# EAGLE schematic Castle_2_2_2_060623 (EAGLE 9.3.0)
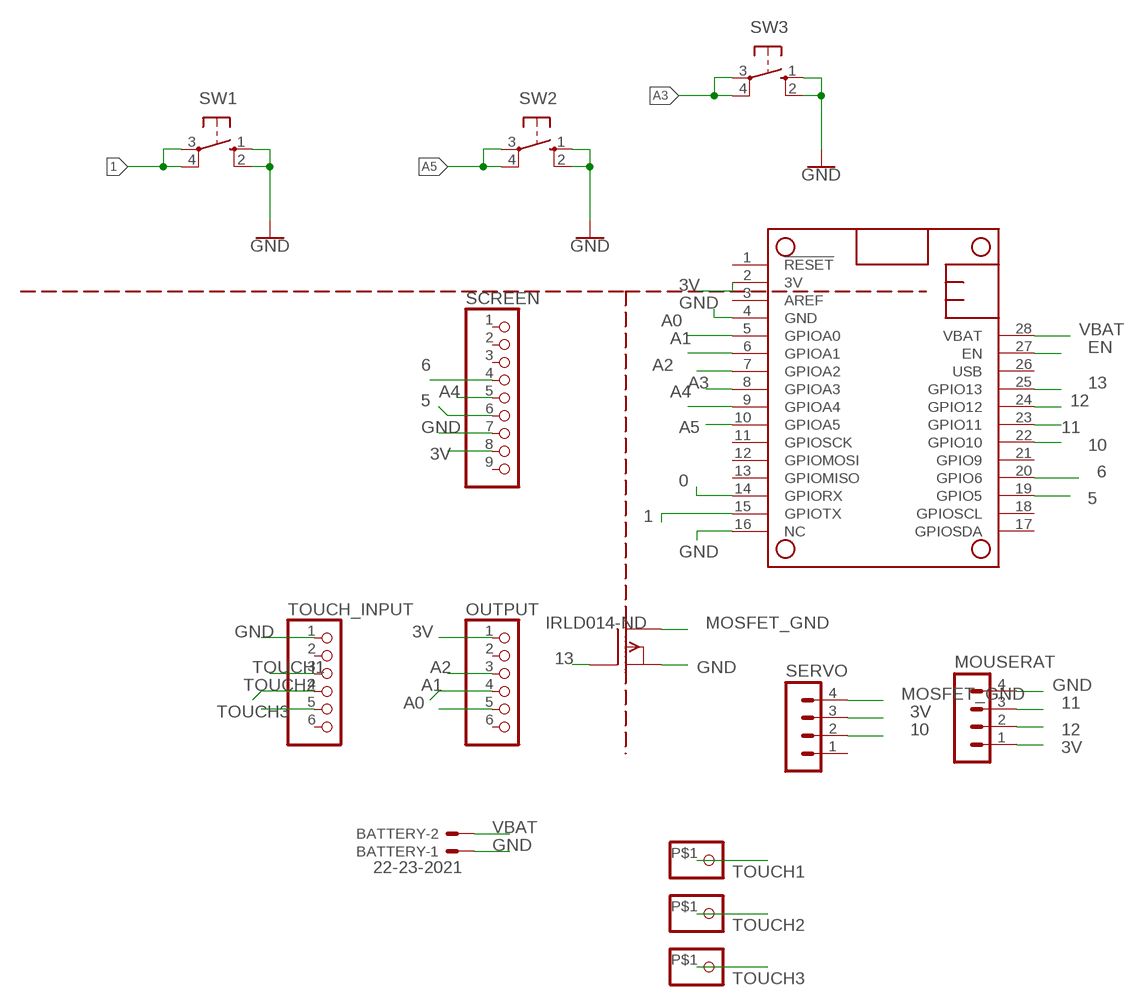
[diagram p0: schematic, sheet 1]

## Parts
BATTERY  22-23-2021  [22-23-2021]
EXTRAGND  PINHD-1X1-BIGPOGO  [1X1-BIGPOGO]
EXTRAGND1  PINHD-1X1-BIGPOGO  [1X1-BIGPOGO]
EXTRAGND2  PINHD-1X1-BIGPOGO  [1X1-BIGPOGO]
IRLD014-ND  IRFD9210  [DIL04]
MOUSERAT  MA04-1  [MA04-1]
MS2  FEATHERWING_NODIM  [FEATHERWING_DIM]
OUTPUT  PINHD-1X6  [1X06]
SCREEN  PINHD-1X9  [1X09-BIG]
SERVO  MA04-1  [MA04-1]
SW1  10-XX  [B3F-10XX]
SW2  10-XX  [B3F-10XX]
SW3  10-XX  [B3F-10XX]
TOUCH_INPUT  PINHD-1X6  [1X06]

## Nets
0: MS2.14(GPIORX)
1: MS2.15(GPIOTX) SW1.3(P) SW1.4(P1)
3V: MOUSERAT.1 MS2.2(3V) OUTPUT.1 SCREEN.8 SERVO.3
5: MS2.19(GPIO5) SCREEN.6
6: MS2.20(GPIO6) SCREEN.4
10: MS2.22(GPIO10) SERVO.2
11: MOUSERAT.3 MS2.23(GPIO11)
12: MOUSERAT.2 MS2.24(GPIO12)
13: IRLD014-ND.1(G) MS2.25(GPIO13)
A0: MS2.5(GPIOA0) OUTPUT.5
A1: MS2.6(GPIOA1) OUTPUT.4
A2: MS2.7(GPIOA2) OUTPUT.3
A3: MS2.8(GPIOA3) SW3.3(P) SW3.4(P1)
A4: MS2.9(GPIOA4) SCREEN.5
A5: MS2.10(GPIOA5) SW2.3(P) SW2.4(P1)
EN: MS2.27(EN)
GND: BATTERY.1 IRLD014-ND.2(S) MOUSERAT.4 MS2.4(GND) MS2.16(NC) SCREEN.7 SW1.1(S) SW1.2(S1) SW2.1(S) SW2.2(S1) SW3.1(S) SW3.2(S1) TOUCH_INPUT.1
MOSFET_GND: IRLD014-ND.3(D) IRLD014-ND.4(D) SERVO.4
TOUCH1: EXTRAGND.P$1 TOUCH_INPUT.3
TOUCH2: EXTRAGND1.P$1 TOUCH_INPUT.4
TOUCH3: EXTRAGND2.P$1 TOUCH_INPUT.5
VBAT: BATTERY.2 MS2.28(VBAT)
Unconnected: MS2.1(!RESET) MS2.3(AREF) MS2.11(GPIOSCK) MS2.12(GPIOMOSI) MS2.13(GPIOMISO) MS2.17(GPIOSDA) MS2.18(GPIOSCL) MS2.21(GPIO9) MS2.26(USB) OUTPUT.2 OUTPUT.6 SCREEN.1 SCREEN.2 SCREEN.3 SCREEN.9 SERVO.1 TOUCH_INPUT.2 TOUCH_INPUT.6

## Library data of the parts
BATTERY = con-molex:22-23-2021: .100" (2.54mm) Center Header - 2 Pin; MF: MOLEX; MPN: 22-23-2021; OC_FARNELL: 1462926; OC_NEWARK: 25C3832
EXTRAGND EXTRAGND1 EXTRAGND2 = adafruit:PINHD-1X1: Pin header 1x1 for 0.1" spacing With round pins
IRLD014-ND = transistor-fet:IRFD9210: P-Channel Enhancement MOSFET
MOUSERAT SERVO = con-lstb:MA04-1: PIN HEADER; OC_FARNELL: unknown; OC_NEWARK: unknown
MS2 = adafruit:FEATHERWING: featherwingflip
OUTPUT TOUCH_INPUT = adafruit:PINHD-1X6: PIN HEADER
SCREEN = adafruit:PINHD-1X9: Pin header 1x10 0.1" spacing With round pins
SW1-SW3 = buttons:10-XX: OMRON SWITCH